# EAGLE design clock (EAGLE 6.4)
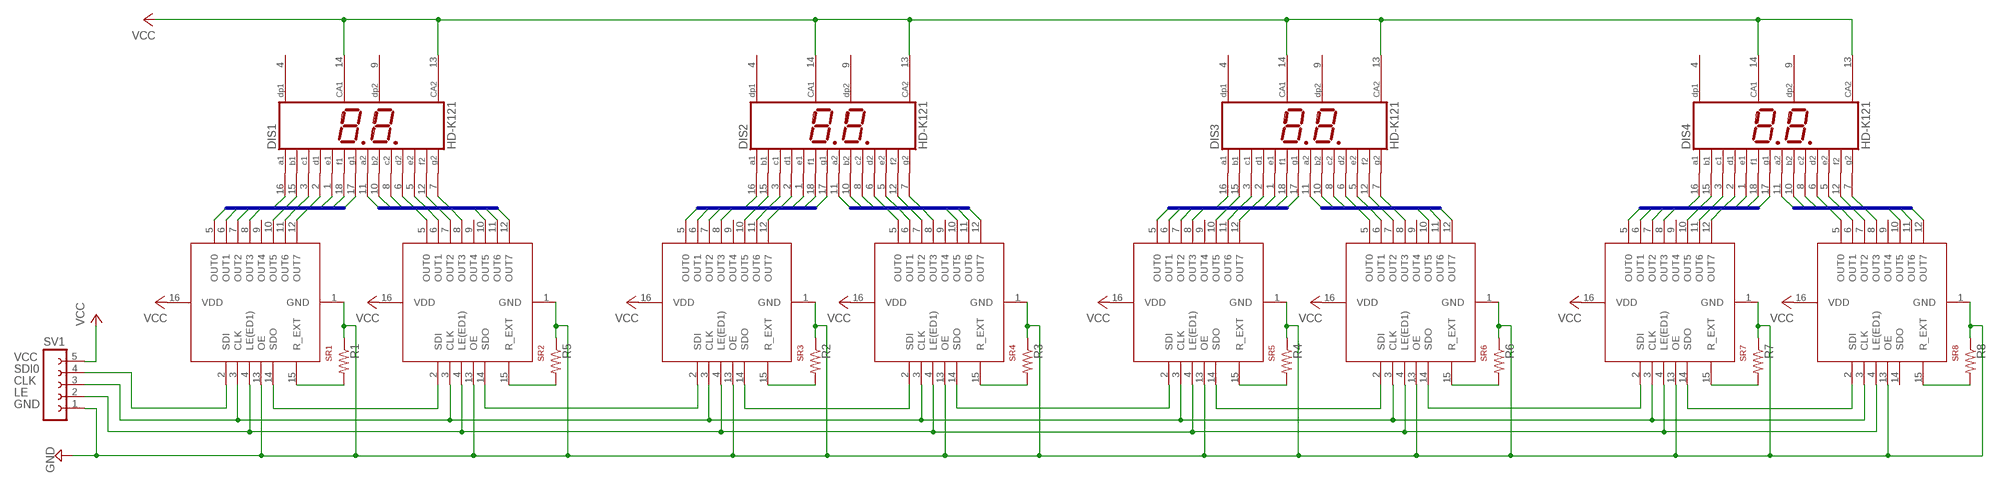
[diagram p0: schematic, sheet 1]

## Parts
DIS1  HD-K121  [HDSP-R]
DIS2  HD-K121  [HDSP-R]
DIS3  HD-K121  [HDSP-R]
DIS4  HD-K121  [HDSP-R]
R1  R-US_R0603  [R0603]
R2  R-US_R0603  [R0603]
R3  R-US_R0603  [R0603]
R4  R-US_R0603  [R0603]
R5  R-US_R0603  [R0603]
R6  R-US_R0603  [R0603]
R7  R-US_R0603  [R0603]
R8  R-US_R0603  [R0603]
SR1  TLC5916/17  [SOIC-16]
SR2  TLC5916/17  [SOIC-16]
SR3  TLC5916/17  [SOIC-16]
SR4  TLC5916/17  [SOIC-16]
SR5  TLC5916/17  [SOIC-16]
SR6  TLC5916/17  [SOIC-16]
SR7  TLC5916/17  [SOIC-16]
SR8  TLC5916/17  [SOIC-16]
SV1  FE05-1  [FE05-1]

## Nets
CLK: SR1.3(CLK) SR2.3(CLK) SR3.3(CLK) SR4.3(CLK) SR5.3(CLK) SR6.3(CLK) SR7.3(CLK) SR8.3(CLK) SV1.3
DAYSONES0: DIS1.11(A2) SR2.11(OUT6)
DAYSONES1: DIS1.10(B2) SR2.12(OUT7)
DAYSONES2: DIS1.8(C2) SR2.5(OUT0)
DAYSONES3: DIS1.6(D2) SR2.7(OUT2)
DAYSONES4: DIS1.5(E2) SR2.8(OUT3)
DAYSONES5: DIS1.12(F2) SR2.10(OUT5)
DAYSONES6: DIS1.7(G2) SR2.6(OUT1)
DAYSTENS0: DIS1.16(A1) SR1.7(OUT2)
DAYSTENS1: DIS1.15(B1) SR1.8(OUT3)
DAYSTENS2: DIS1.3(C1) SR1.10(OUT5)
DAYSTENS3: DIS1.2(D1) SR1.11(OUT6)
DAYSTENS4: DIS1.1(E1) SR1.12(OUT7)
DAYSTENS5: DIS1.18(F1) SR1.5(OUT0)
DAYSTENS6: DIS1.17(G1) SR1.6(OUT1)
GND: R1.1 R2.1 R3.1 R4.1 R5.1 R6.1 R7.1 R8.1 SR1.1(GND) SR1.13(OE) SR2.1(GND) SR2.13(OE) SR3.1(GND) SR3.13(OE) SR4.1(GND) SR4.13(OE) SR5.1(GND) SR5.13(OE) SR6.1(GND) SR6.13(OE) SR7.1(GND) SR7.13(OE) SR8.1(GND) SR8.13(OE) SV1.1
HOURSONES0: DIS2.11(A2) SR4.11(OUT6)
HOURSONES1: DIS2.10(B2) SR4.12(OUT7)
HOURSONES2: DIS2.8(C2) SR4.5(OUT0)
HOURSONES3: DIS2.6(D2) SR4.7(OUT2)
HOURSONES4: DIS2.5(E2) SR4.8(OUT3)
HOURSONES5: DIS2.12(F2) SR4.10(OUT5)
HOURSONES6: DIS2.7(G2) SR4.6(OUT1)
HOURSTENS0: DIS2.16(A1) SR3.7(OUT2)
HOURSTENS1: DIS2.15(B1) SR3.8(OUT3)
HOURSTENS2: DIS2.3(C1) SR3.10(OUT5)
HOURSTENS3: DIS2.2(D1) SR3.11(OUT6)
HOURSTENS4: DIS2.1(E1) SR3.12(OUT7)
HOURSTENS5: DIS2.18(F1) SR3.5(OUT0)
HOURSTENS6: DIS2.17(G1) SR3.6(OUT1)
LE: SR1.4(LE(ED1)) SR2.4(LE(ED1)) SR3.4(LE(ED1)) SR4.4(LE(ED1)) SR5.4(LE(ED1)) SR6.4(LE(ED1)) SR7.4(LE(ED1)) SR8.4(LE(ED1)) SV1.2
MINUTESONES0: DIS3.11(A2) SR6.11(OUT6)
MINUTESONES1: DIS3.10(B2) SR6.12(OUT7)
MINUTESONES2: DIS3.8(C2) SR6.5(OUT0)
MINUTESONES3: DIS3.6(D2) SR6.7(OUT2)
MINUTESONES4: DIS3.5(E2) SR6.8(OUT3)
MINUTESONES5: DIS3.12(F2) SR6.10(OUT5)
MINUTESONES6: DIS3.7(G2) SR6.6(OUT1)
MINUTESTENS0: DIS3.16(A1) SR5.7(OUT2)
MINUTESTENS1: DIS3.15(B1) SR5.8(OUT3)
MINUTESTENS2: DIS3.3(C1) SR5.10(OUT5)
MINUTESTENS3: DIS3.2(D1) SR5.11(OUT6)
MINUTESTENS4: DIS3.1(E1) SR5.12(OUT7)
MINUTESTENS5: DIS3.18(F1) SR5.5(OUT0)
MINUTESTENS6: DIS3.17(G1) SR5.6(OUT1)
N$7: R3.2 SR4.15(R_EXT)
N$8: R2.2 SR3.15(R_EXT)
N$11: R5.2 SR2.15(R_EXT)
N$15: R1.2 SR1.15(R_EXT)
N$16: R6.2 SR6.15(R_EXT)
N$17: R4.2 SR5.15(R_EXT)
N$24: R8.2 SR8.15(R_EXT)
N$25: R7.2 SR7.15(R_EXT)
SDI0: SR1.2(SDI) SV1.4
SDI1: SR1.14(SDO) SR2.2(SDI)
SDI2: SR2.14(SDO) SR3.2(SDI)
SDI3: SR3.14(SDO) SR4.2(SDI)
SDI4: SR4.14(SDO) SR5.2(SDI)
SDI5: SR5.14(SDO) SR6.2(SDI)
SDI6: SR6.14(SDO) SR7.2(SDI)
SDI7: SR7.14(SDO) SR8.2(SDI)
SECONDSONES0: DIS4.11(A2) SR8.11(OUT6)
SECONDSONES1: DIS4.10(B2) SR8.12(OUT7)
SECONDSONES2: DIS4.8(C2) SR8.5(OUT0)
SECONDSONES3: DIS4.6(D2) SR8.7(OUT2)
SECONDSONES4: DIS4.5(E2) SR8.8(OUT3)
SECONDSONES5: DIS4.12(F2) SR8.10(OUT5)
SECONDSONES6: DIS4.7(G2) SR8.6(OUT1)
SECONDSTENS0: DIS4.16(A1) SR7.7(OUT2)
SECONDSTENS1: DIS4.15(B1) SR7.8(OUT3)
SECONDSTENS2: DIS4.3(C1) SR7.10(OUT5)
SECONDSTENS3: DIS4.2(D1) SR7.11(OUT6)
SECONDSTENS4: DIS4.1(E1) SR7.12(OUT7)
SECONDSTENS5: DIS4.18(F1) SR7.5(OUT0)
SECONDSTENS6: DIS4.17(G1) SR7.6(OUT1)
VCC: DIS1.13(CA2) DIS1.14(CA1) DIS2.13(CA2) DIS2.14(CA1) DIS3.13(CA2) DIS3.14(CA1) DIS4.13(CA2) DIS4.14(CA1) SR1.16(VDD) SR2.16(VDD) SR3.16(VDD) SR4.16(VDD) SR5.16(VDD) SR6.16(VDD) SR7.16(VDD) SR8.16(VDD) SV1.5
Unconnected: DIS1.4(DP1) DIS1.9(DP2) DIS2.4(DP1) DIS2.9(DP2) DIS3.4(DP1) DIS3.9(DP2) DIS4.4(DP1) DIS4.9(DP2) SR1.9(OUT4) SR2.9(OUT4) SR3.9(OUT4) SR4.9(OUT4) SR5.9(OUT4) SR6.9(OUT4) SR7.9(OUT4) SR8.9(OUT4) SR8.14(SDO)

## Buses
SECONDSTENS[0..6]
SECONDSONES[0..6]
DAYSTENS[0..6]
DAYSONES[0..6]
HOURSTENS[0..6]
HOURSONES[0..6]
MINUTESTENS[0..6]
MINUTESONES[0..6]

## Library data of the parts
DIS1-DIS4 = display-hp:HD-K121: LED DISPLAY 2 x 1 character 7 segment, decimal points right; OC_FARNELL: unknown; OC_NEWARK: unknown
R1-R8 = resistor:R-US_: RESISTOR, American symbol
SR1-SR8 = BillPorter:TLC5916/17: TLC5916/17 8-Channel Constant-Current LED Sink Driver and Shift Register in one. Great for driving high current LEDs that would kill a 595 shift register. Specs @ http://focus.ti.com/docs/prod/folders/print/tlc5916.html
SV1 = con-lsta:FE05-1: FEMALE HEADER; OC_FARNELL: unknown; OC_NEWARK: unknown

## Board
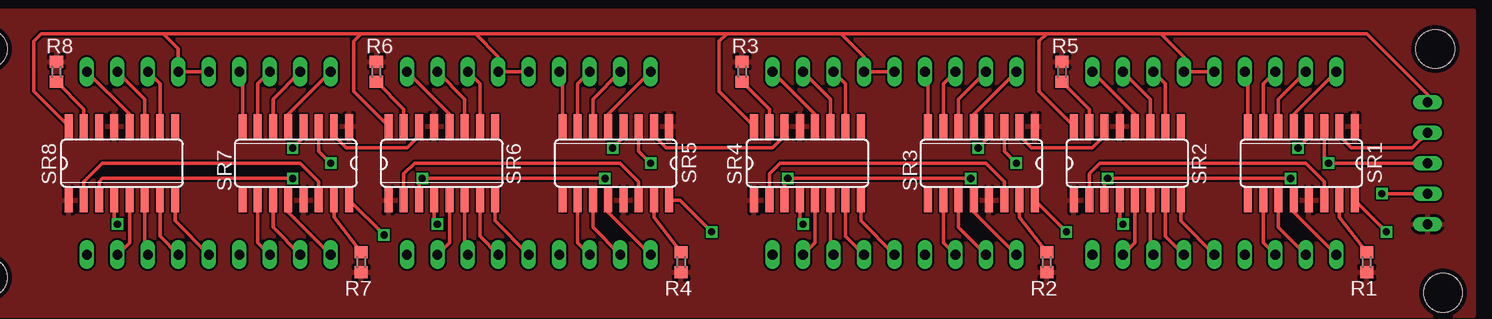
[diagram p1: board, top side]
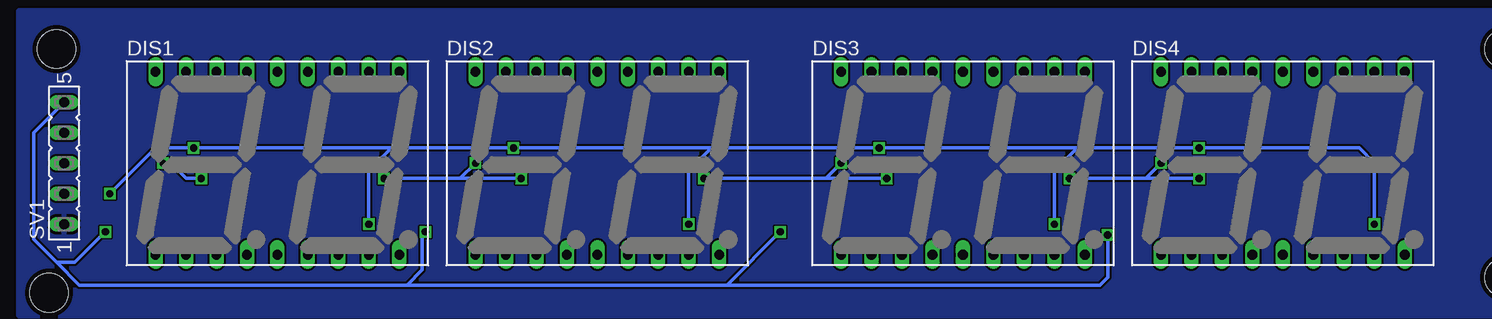
[diagram p2: board, bottom side, seen from below]

No outline drawn. Coordinates in mm, seen from the top.
Copper layers (1*16): Top 0.0356mm / dielectric 1.5011mm / Bottom 0.0356mm
Design rules "LaenPCBOrder": minimum track width 6mil, minimum drill 13mil, track to track 6mil, track to pad 6mil, pad to pad 6mil, via to via 6mil, smd to smd 6mil, copper to edge 15mil, drill to drill 6mil, minimum pad ring 7mil, minimum via ring 7mil, stop-mask expansion 4mil, vias tented up to drill 0mil, thermal gap 10mil
Holes 3.2 mm at 3.17,22.23 123.83,22.23 124.46,1.91 3.17,3.17

### Footprints (pad centres in the part's own frame; a part is rotated, then mirrored left to right if it is on the bottom)
HDSP-R = drill 0.813 long: 1 -10.16,-7.62; 2 -7.62,-7.62; 3 -5.08,-7.62; 4 -2.54,-7.62; 5 0,-7.62; 6 2.54,-7.62; 7 5.08,-7.62; 8 7.62,-7.62; 9 10.16,-7.62; 10 10.16,7.62; 11 7.62,7.62; 12 5.08,7.62; 13 2.54,7.62; 14 0,7.62; 15 -2.54,7.62; 16 -5.08,7.62; 17 -7.62,7.62; 18 -10.16,7.62
R0603 = smd 1 x 1.1: 1 -0.85,0; 2 0.85,0
SOIC-16 = smd 0.66 x 2.032: 1 -4.075,-3.073; 2 -2.805,-3.073; 3 -1.535,-3.073; 4 -0.265,-3.073; 5 1.005,-3.073; 6 2.275,-3.073; 7 3.545,-3.073; 8 4.815,-3.073; 9 4.815,3.073; 10 3.545,3.073; 11 2.275,3.073; 12 1.005,3.073; 13 -0.265,3.073; 14 -1.535,3.073; 15 -2.805,3.073; 16 -4.075,3.073
FE05-1 = drill 0.813 long: 1 -5.08,0; 2 -2.54,0; 3 0,0; 4 2.54,0; 5 5.08,0

### Placement (x,y rotation side)
DIS1  105.41,12.7 0 bottom
DIS2  78.74,12.7 0 bottom
DIS3  48.26,12.7 0 bottom
DIS4  21.59,12.7 0 bottom
R1  118.11,4.45 90 top
R2  91.44,4.45 90 top
R3  66.04,20.32 270 top
R4  60.96,4.45 90 top
R5  92.71,20.32 270 top
R6  35.56,20.32 270 top
R7  34.29,4.45 90 top
R8  8.89,20.32 270 top
SR1  113.03,12.7 180 top
SR2  97.79,12.7 0 top
SR3  86.36,12.7 180 top
SR4  71.12,12.7 0 top
SR5  55.88,12.7 180 top
SR6  40.64,12.7 0 top
SR7  29.21,12.7 180 top
SR8  13.97,12.7 0 top
SV1  123.19,12.7 90 bottom

### Tracks (layer width: path | path; a pad name or v marks a point on that pad's centre or on a via)
CLK  (via drill 0.6)
  Top 0.305: v28.57,11.43 12.7,11.43 12.44,11.16 SR8.3 | SR6.3 39.1,11.16 v39.37,11.43 v54.61,11.43 | v31.75,12.7 30.75,13.71 SR7.3 | SR4.3 69.58,11.16 v69.85,11.43 v85.09,11.43 | v58.42,12.7 57.41,13.71 SR5.3 | SR2.3 96.25,11.16 v96.52,11.43 v111.76,11.43 | v88.9,12.7 87.89,13.71 SR3.3 | SR1.3 114.56,13.07 v114.94,12.7 SV1.3
  Bottom 0.305: v28.57,11.43 33.02,11.43 | 33.02,11.43 v39.37,11.43 | v31.75,12.7 33.02,11.43 | v54.61,11.43 59.69,11.43 | 59.69,11.43 v69.85,11.43 | v58.42,12.7 59.69,11.43 | 90.17,11.43 v96.52,11.43 | v85.09,11.43 90.17,11.43 | 90.17,11.43 v88.9,12.7 | v111.76,11.43 113.03,11.43 114.3,12.7 v114.94,12.7
DAYSONES0
  Top 0.305: DIS1.11 100.06,18.05 SR2.11
DAYSONES1
  Top 0.305: DIS1.10 98.8,16.77 SR2.12
DAYSONES2
  Top 0.305: DIS1.8 98.8,6.08 SR2.5
DAYSONES3
  Top 0.305: DIS1.6 101.33,6.62 SR2.7
DAYSONES4
  Top 0.305: DIS1.5 102.61,7.88 SR2.8
DAYSONES5
  Top 0.305: DIS1.12 101.33,19.32 SR2.10
DAYSONES6
  Top 0.305: DIS1.7 100.06,5.34 SR2.6
DAYSTENS0
  Top 0.305: DIS1.16 109.48,19.32 SR1.7
DAYSTENS1
  Top 0.305: DIS1.15 108.22,20.05 SR1.8
DAYSTENS2
  Top 0.305: DIS1.3 109.48,6.08 SR1.10
DAYSTENS3
  Top 0.305: DIS1.2 110.75,7.36 SR1.11
DAYSTENS4
  Top 0.305: DIS1.1 112.03,8.62 SR1.12
DAYSTENS5
  Top 0.305: DIS1.18 112.03,16.77 SR1.5
DAYSTENS6
  Top 0.305: DIS1.17 110.75,18.05 SR1.6
GND
  pour Top: 0,0 0,25.4 127,25.4 127,0
  pour Bottom: 0,0 0,25.4 127,25.4 127,0
HOURSONES0
  Top 0.305: DIS2.11 73.39,18.05 SR4.11
HOURSONES1
  Top 0.305: DIS2.10 72.12,16.77 SR4.12
HOURSONES2
  Top 0.305: DIS2.8 72.12,6.08 SR4.5
HOURSONES3
  Top 0.305: DIS2.6 74.67,6.62 SR4.7
HOURSONES4
  Top 0.305: DIS2.5 75.94,7.88 SR4.8
HOURSONES5
  Top 0.305: DIS2.12 74.67,19.32 SR4.10
HOURSONES6
  Top 0.305: DIS2.7 73.39,5.34 SR4.6
HOURSTENS0
  Top 0.305: DIS2.16 82.81,19.32 SR3.7
HOURSTENS1
  Top 0.305: DIS2.15 81.55,20.05 SR3.8
HOURSTENS2
  Top 0.305: DIS2.3 82.81,6.08 SR3.10
HOURSTENS3
  Top 0.305: DIS2.2 84.08,7.36 SR3.11
HOURSTENS4
  Top 0.305: DIS2.1 85.36,8.62 SR3.12
HOURSTENS5
  Top 0.305: DIS2.18 85.36,16.77 SR3.5
HOURSTENS6
  Top 0.305: DIS2.17 84.08,18.05 SR3.6
LE  (via drill 0.6)
  Top 0.305: v28.57,13.97 29.48,14.87 SR7.4 | v13.97,7.62 13.71,7.88 SR8.4 | v40.64,7.62 40.38,7.88 SR6.4 | v55.24,13.97 56.15,14.87 SR5.4 | v71.12,7.62 70.86,7.88 SR4.4 | v85.72,13.97 86.62,14.87 SR3.4 | v97.79,7.62 97.53,7.88 SR2.4 | v112.39,13.97 113.3,14.87 SR1.4 | SV1.2 v119.38,10.16
  Bottom 0.305: v13.97,7.62 13.97,12.7 15.24,13.97 v28.57,13.97 38.73,13.97 | v40.64,7.62 40.64,12.06 38.73,13.97 | 38.73,13.97 v55.24,13.97 69.22,13.97 | v71.12,7.62 71.12,12.06 69.22,13.97 | 69.22,13.97 v85.72,13.97 95.89,13.97 | v97.79,7.62 97.79,12.06 95.89,13.97 | 95.89,13.97 v112.39,13.97 115.57,13.97 v119.38,10.16
MINUTESONES0
  Top 0.305: DIS3.11 42.91,18.05 SR6.11
MINUTESONES1
  Top 0.305: DIS3.10 41.65,16.77 SR6.12
MINUTESONES2
  Top 0.305: DIS3.8 41.65,6.08 SR6.5
MINUTESONES3
  Top 0.305: DIS3.6 44.19,6.62 SR6.7
MINUTESONES4
  Top 0.305: DIS3.5 45.45,7.88 SR6.8
MINUTESONES5
  Top 0.305: DIS3.12 44.19,19.32 SR6.10
MINUTESONES6
  Top 0.305: DIS3.7 42.91,5.34 SR6.6
MINUTESTENS0
  Top 0.305: DIS3.16 52.34,19.32 SR5.7
MINUTESTENS1
  Top 0.305: DIS3.15 51.06,20.05 SR5.8
MINUTESTENS2
  Top 0.305: DIS3.3 52.34,6.08 SR5.10
MINUTESTENS3
  Top 0.305: DIS3.2 53.6,7.36 SR5.11
MINUTESTENS4
  Top 0.305: DIS3.1 54.88,8.62 SR5.12
MINUTESTENS5
  Top 0.305: DIS3.18 54.88,16.77 SR5.5
MINUTESTENS6
  Top 0.305: DIS3.17 53.6,18.05 SR5.6
N$7
  Top 0.305: R3.2 68.31,17.2 SR4.15
N$8
  Top 0.305: R2.2 89.17,8.21 SR3.15
N$11
  Top 0.305: R5.2 94.98,17.2 SR2.15
N$15
  Top 0.305: R1.2 115.83,8.21 SR1.15
N$16
  Top 0.305: R6.2 37.84,17.2 SR6.15
N$17
  Top 0.305: R4.2 58.69,8.21 SR5.15
N$24
  Top 0.305: R8.2 11.16,17.2 SR8.15
N$25
  Top 0.305: R7.2 32.02,8.21 SR7.15
SDI0
  Top 0.305: SV1.4 121.92,13.97 116.84,13.97 115.83,14.97 SR1.2
SDI1
  Top 0.305: SR1.14 114.56,11.16 113.03,12.7 95.89,12.7 94.98,11.8 SR2.2
SDI2
  Top 0.305: SR2.14 96.25,14.97 95.25,13.97 90.17,13.97 89.17,14.97 SR3.2
SDI3
  Top 0.305: SR3.14 87.89,11.16 86.36,12.7 69.22,12.7 68.31,11.8 SR4.2
SDI4
  Top 0.305: SR4.14 69.58,14.97 68.58,13.97 59.69,13.97 58.69,14.97 SR5.2
SDI5
  Top 0.305: SR5.14 57.41,11.16 55.88,12.7 38.73,12.7 37.84,11.8 SR6.2
SDI6
  Top 0.305: SR6.14 39.1,14.97 38.1,13.97 33.02,13.97 32.02,14.97 SR7.2
SDI7
  Top 0.305: SR7.14 30.75,11.16 29.21,12.7 12.7,12.7 11.16,11.16 SR8.2
SECONDSONES0
  Top 0.305: DIS4.11 16.25,18.05 SR8.11
SECONDSONES1
  Top 0.305: DIS4.10 14.97,16.77 SR8.12
SECONDSONES2
  Top 0.305: DIS4.8 14.97,6.08 SR8.5
SECONDSONES3
  Top 0.305: DIS4.6 17.52,6.62 SR8.7
SECONDSONES4
  Top 0.305: DIS4.5 18.79,7.88 SR8.8
SECONDSONES5
  Top 0.305: DIS4.12 17.52,19.32 SR8.10
SECONDSONES6
  Top 0.305: DIS4.7 16.25,5.34 SR8.6
SECONDSTENS0
  Top 0.305: DIS4.16 25.66,19.32 SR7.7
SECONDSTENS1
  Top 0.305: DIS4.15 24.39,20.05 SR7.8
SECONDSTENS2
  Top 0.305: DIS4.3 25.66,6.08 SR7.10
SECONDSTENS3
  Top 0.305: DIS4.2 26.93,7.36 SR7.11
SECONDSTENS4
  Top 0.305: DIS4.1 28.2,8.62 SR7.12
SECONDSTENS5
  Top 0.305: DIS4.18 28.2,16.77 SR7.5
SECONDSTENS6
  Top 0.305: DIS4.17 26.93,18.05 SR7.6
VCC  (via drill 0.6)
  Top 0.305: SR8.16 6.99,18.68 6.99,22.86 7.62,23.5 17.78,23.5 | 17.78,23.5 19.05,22.23 DIS4.13 DIS4.14 | SR6.16 33.66,18.68 33.66,22.86 34.29,23.5 | 34.29,23.5 43.81,23.5 | 43.81,23.5 45.72,21.59 DIS3.13 DIS3.14 | 34.29,23.5 17.78,23.5 | 64.77,23.5 74.3,23.5 | 74.3,23.5 76.2,21.59 DIS2.13 DIS2.14 | SR4.16 64.14,18.68 64.14,22.86 64.77,23.5 | 64.77,23.5 43.81,23.5 | SR2.16 90.81,18.68 90.81,22.86 91.44,23.5 | 91.44,23.5 100.97,23.5 | 91.44,23.5 74.3,23.5 | DIS1.14 DIS1.13 102.87,21.59 100.97,23.5 | 100.97,23.5 118.11,23.5 123.19,18.41 SV1.5 | SR5.16 60.86,9.63 v63.5,6.99 | SR7.16 v36.2,6.72 | SR3.16 v93.08,6.99 | SR1.16 v119.75,6.99
  Bottom 0.305: v36.2,6.72 36.2,3.17 36.83,2.54 67.94,2.54 | 67.94,2.54 94.61,2.54 | 94.61,2.54 121.92,2.54 123.83,4.45 | v63.5,6.99 67.94,2.54 | v93.08,6.99 93.34,6.72 93.34,3.81 94.61,2.54 | 123.83,4.45 125.73,6.35 125.73,15.24 SV1.5 | v119.75,6.99 122.29,4.45 123.83,4.45